# Altium schematic sheet [4] - EthernetPHY.SchDoc
size 420 x 297 mm; ENG_APP_DATE: --/--/--; DSN_APP_DATE: --/--/--; CHK_APP_DATE: --/--/--; DocumentNumber: 4; SheetNumber: 4; SheetTotal: 11
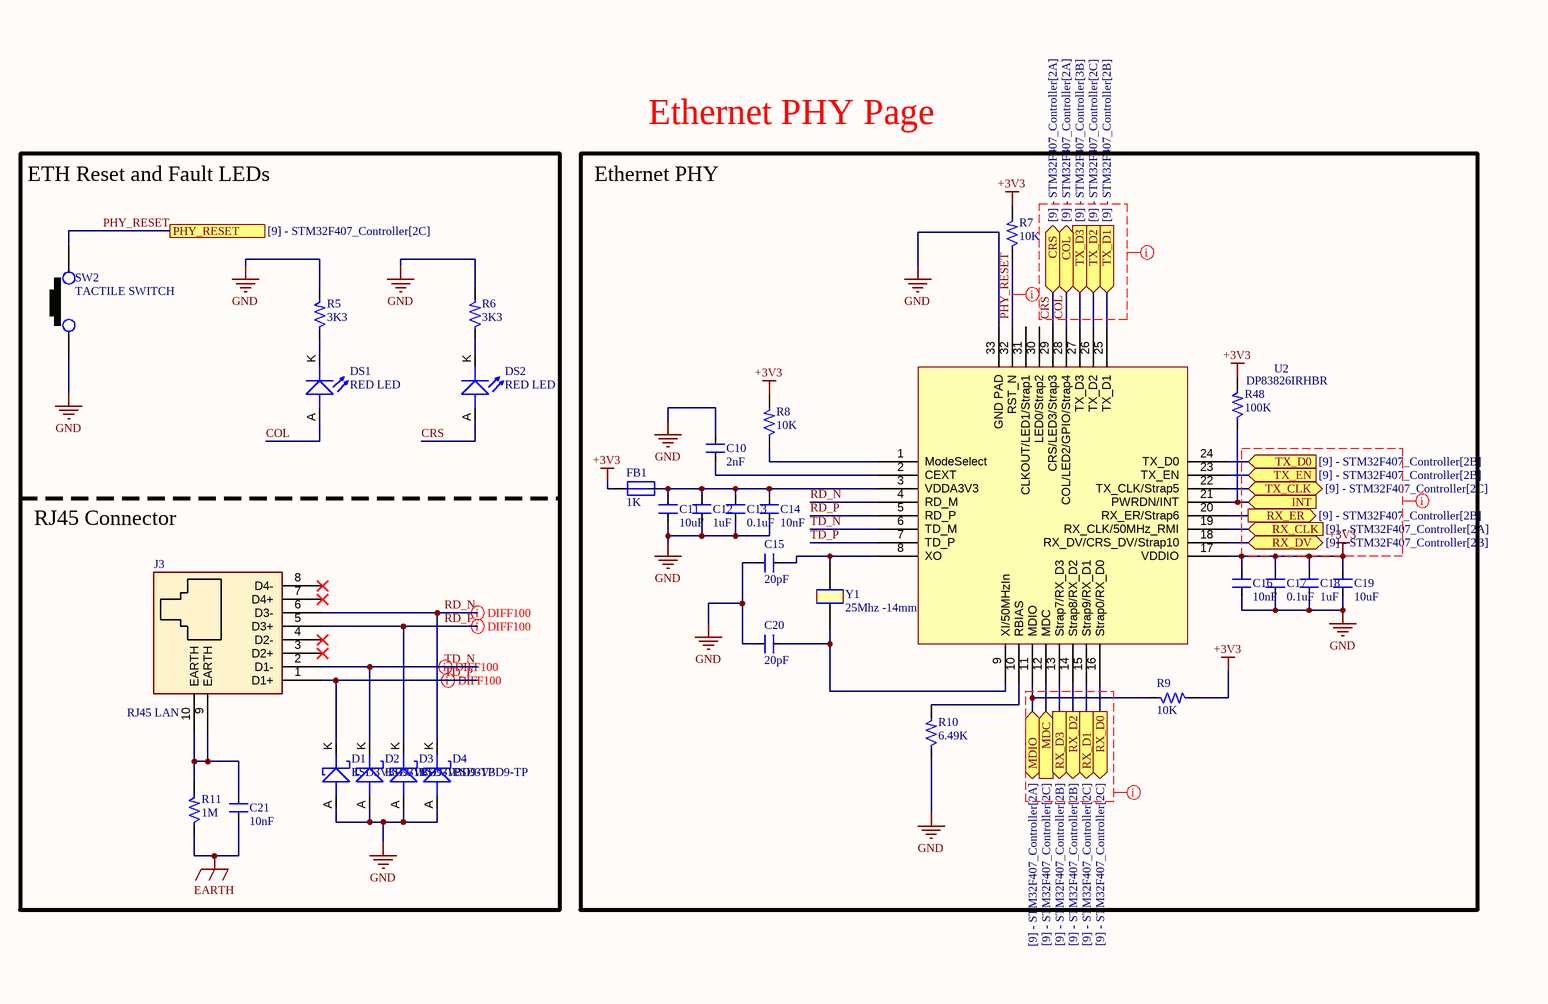
[diagram p0: [4] - EthernetPHY.SchDoc]

## Parts
C10  2nF  [CAP_0805]
C11  10uF  [CAP_1206]
C12  1uF  [CAP_0805]
C13  0.1uF  [CAP_0805]
C14  10nF  [CAP_0805]
C15  20pF  [CAP_0805]
C16  10nF  [CAP_0805]
C17  0.1uF  [CAP_0805]
C18  1uF  [CAP_0805]
C19  10uF  [CAP_1206]
C20  20pF  [CAP_0805]
C21  10nF  [CAP_P196_102X287_H332_RAD_TH]
D1  ESD3V3D9-TP  [DIO_SOD-923]
D2  ESD3V3D9-TP  [DIO_SOD-923]
D3  ESD3V3D9-TP  [DIO_SOD-923]
D4  ESD3V3D9-TP  [DIO_SOD-923]
DS1  RED LED  [LED_0805]
DS2  RED LED  [LED_0805]
FB1  1K  [IND_0805]
J3  RJ45 LAN  [CON10_P106_RJ45_TH_ST]
R5  3K3  [RES_0603]
R6  3K3  [RES_0603]
R7  10K  [RES_0603]
R8  10K  [RES_0603]
R9  10K  [RES_0603]
R10  6.49K  [RES_0805]
R11  1M  [RES_1206]
R48  100K  [RES_0603]
SW2  TACTILE SWITCH  [SW_342_SMD]
U2  DP83826IRHBR  [VQFN32_19_218_23X9_SMD]
Y1  25Mhz -14mm  [XTAL_314_240X47_SMD]

## Blocks framed on the sheet
Ethernet PHY: C10-C20 FB1 R7-R10 R48 U2 Y1

## Ports
COL (bidir, see [9] - STM32F407_Controller[2A]), CRS (bidir, see [9] - STM32F407_Controller[2A]), INT (in), MDC (in, see [9] - STM32F407_Controller[2C]), MDIO (bidir, see [9] - STM32F407_Controller[2A]), PHY_RESET (see [9] - STM32F407_Controller[2C]), RX_CLK (in, see [9] - STM32F407_Controller[2A]), RX_D0 (out, see [9] - STM32F407_Controller[2C]), RX_D1 (out, see [9] - STM32F407_Controller[2C]), RX_D2 (out, see [9] - STM32F407_Controller[2B]), RX_D3 (out, see [9] - STM32F407_Controller[2B]), RX_DV (bidir, see [9] - STM32F407_Controller[2B]), RX_ER (out, see [9] - STM32F407_Controller[2B]), TX_CLK (bidir, see [9] - STM32F407_Controller[2C]), TX_D0 (in, see [9] - STM32F407_Controller[2B]), TX_D1 (in, see [9] - STM32F407_Controller[2B]), TX_D2 (in, see [9] - STM32F407_Controller[2C]), TX_D3 (in, see [9] - STM32F407_Controller[3B]), TX_EN (in, see [9] - STM32F407_Controller[2B])

## Nets
+3V3: C16.1 C17.2 C18.1 C19.2 FB1.1 R7.2 R8.2 R9.2 R48.2 U2.17(VDDIO)
EARTH: C21.1 R11.1
GND: C10.1 C11.1 C12.1 C13.2 C14.1 C15.1 C16.2 C17.1 C18.2 C19.1 C20.1 D1.A D2.A D3.A D4.A R5.2 R6.2 R10.1 SW2.1 U2.33(GND_PAD)
COL: DS1.A(ANODE) U2.28(COL/LED2/GPIO/Strap4) ; port COL
CRS: DS2.A(ANODE) U2.29(CRS/LED3/Strap3) ; port CRS
INT: R48.1 U2.21(PWRDN/INT) ; port INT
MDC: U2.12(MDC) ; port MDC
MDIO: R9.1 U2.11(MDIO) ; port MDIO
PHY_RESET: R7.1 SW2.2 U2.32(RST_N) ; port PHY_RESET
RD_N: D4.K J3.6(D3-) U2.4(RD_M)
RD_P: D3.K J3.5(D3+) U2.5(RD_P)
RX_CLK: U2.19(RX_CLK/50MHz_RMI) ; port RX_CLK
RX_D0: U2.16(Strap0/RX_D0) ; port RX_D0
RX_D1: U2.15(Strap9/RX_D1) ; port RX_D1
RX_D2: U2.14(Strap8/RX_D2) ; port RX_D2
RX_D3: U2.13(Strap7/RX_D3) ; port RX_D3
RX_DV: U2.18(RX_DV/CRS_DV/Strap10) ; port RX_DV
RX_ER: U2.20(RX_ER/Strap6) ; port RX_ER
TD_N: D2.K J3.2(D1-) U2.6(TD_M)
TD_P: D1.K J3.1(D1+) U2.7(TD_P)
TX_CLK: U2.22(TX_CLK/Strap5) ; port TX_CLK
TX_D0: U2.24(TX_D0) ; port TX_D0
TX_D1: U2.25(TX_D1) ; port TX_D1
TX_D2: U2.26(TX_D2) ; port TX_D2
TX_D3: U2.27(TX_D3) ; port TX_D3
TX_EN: U2.23(TX_EN) ; port TX_EN
NetC10_2: C10.2 U2.2(CEXT)
NetC11_2: C11.2 C12.2 C13.1 C14.2 FB1.2 U2.3(VDDA3V3)
NetC15_2: C15.2 U2.8(XO) Y1.2
NetC20_2: C20.2 U2.9(XI/50MHzIn) Y1.1
NetC21_2: C21.2 J3.9(EARTH) J3.10(EARTH) R11.2
NetDS1_K: DS1.K(CATHODE) R5.1
NetDS2_K: DS2.K(CATHODE) R6.1
NetR8_1: R8.1 U2.1(ModeSelect)
NetR10_2: R10.2 U2.10(RBIAS)

Not connected (* = marked no-connect by the designer): J3 3(D2+)* 4(D2-)* 7(D4+)* 8(D4-)*; U2 30(LED0/Strap2) 31(CLKOUT/LED1/Strap1)

## Layout directives
differential pair; differential pair class DIFF100: RD_N, RD_P, TD_N, TD_P
net class 50OHM: (no net found under the mark), +3V3, COL, CRS
net class Critical_Nets: PHY_RESET

## Notes on the sheet
- Ethernet PHY Page
- ETH Reset and Fault LEDs
- RJ45 Connector
- THIS DOCUMENT AND THE DATA DISCLOSED HEREIN OR
- HEREWITH IS THE PROPERTY OF ALTIUM LIMITED AND MAY
- DWG NO:
- REVISION
- REV:
- DESCRIPTION
- DATE
- APPROVED
- BE FREELY DISTRIBUTED IN WHOLE. NO RIGHTS ARE
- RESERVED OR EXPRESS OR IMPLIED WARANTEE GIVEN.
- ENG:
- APPROVALS
- PROJECT
- DSN:
- CHK:
- REFERENCE DOCUMENTS
- PROJECT REVISION:
- TITLE
- DOCUMENT REVISION:
- DESIGN ITEM:
- BOM:
- FAB DWG:
- PCB DWG:
- ASSY DWG:
- SCALE:
- A3
- SIZE
- CAGE CODE
- FILE NAME
- DWG NO.
- SHEET
- OF
- REV

## Library data of the parts
C10 = CAP_2nF-50V-10%-0805: 2000pF ±10% 50V Ceramic Capacitor X7R 0805 (2012 Metric); Manufacturer: Samsung Electro-Mechanics; Manufacturer Part Number: CL21B202KBANNNC; Alternate Part Number-1: NA; Case/Package: 0805; Supplier-1: Digikey; Supplier Part Number-1: 1276-2471-1-ND - Cut Tape (CT)
C11 C19 = CAP_10uF-50V-10%-1206: 10µF ±10% 50V Ceramic Capacitor X7R 1206 (3216 Metric); Manufacturer: KEMET; Manufacturer Part Number: CL31B106KBHNNNE; Alternate Part Number-1: GRT31CR61H106ME01L; Case/Package: 1206; Supplier-1: SIRICOM; Supplier Part Number-1: CC1206KKX5R9BB106
C12 C18 = CAP_1uF-50V-5%-0805: 1µF ±5% 50V Ceramic Capacitor X7R 0805 (2012 Metric); Manufacturer: Samsung; Manufacturer Part Number: CC0805JKX7R9BB105; Alternate Part Number-1: 0805F105M500NT; Case/Package: 0805; Supplier-1: SIRICOM; Supplier Part Number-1: CL21B105KBFNNNE
C13 C17 = CAP_0.1uF-50V-5%-0805: 0.1µF ±5% 50V Ceramic Capacitor X7R 0805 (2012 Metric); Manufacturer: AVX Corporation; Manufacturer Part Number: 08055C104JAT4A; Alternate Part Number-1: 0805B104M500; Case/Package: 0805; Supplier-1: SIRICOM; Supplier Part Number-1: 0805B104J500CT
C14 C16 = CAP_10nF-50V-10%-0805: 10000pF ±10% 50V Ceramic Capacitor X7R 0805 (2012 Metric); Manufacturer: Samsung; Manufacturer Part Number: C0805C103K5RECAUTO; Alternate Part Number-1: GRM2195C1H103JA01D; Case/Package: 0805; Supplier-1: SIRICOM; Supplier Part Number-1: 0805B103K500CT
C15 C20 = CAP_20pF-50V-10%-0805: ±10% 50V Ceramic Capacitor C0G, NP0 0805 (2012 Metric); Manufacturer: AVX Corporation; Manufacturer Part Number: 08055A200KAT2A; Alternate Part Number-1: NA; Case/Package: 0805; Supplier-1: Digikey; Supplier Part Number-1: 478-11887-1-ND - Cut Tape (CT)
C21 = CAP_10nF-1KV-10%-RAD-TH: 10000pF ±10% 1000V (1kV) Ceramic Capacitor X7R Radial; Manufacturer: Yageo; Manufacturer Part Number: RDER73A103K2K1H03B; Alternate Part Number-1: NA; Case/Package: TH; Supplier-1: SP ROAD; Supplier Part Number-1: RDER73A103K2K1H03B
D1-D4 = DIO-T_3.3V-8.8V-10A-SOD923: TVS DIODE 3.3V 8.8V SOD923; Manufacturer: Micro Commercial Co; Alternate Part Number-1: NA; Manufacturer Part Number: ESD3V3D9-TP; Case/Package: SOD923; Supplier-1: Digikey; Supplier Part Number-1: ESD3V3D9-TPMSTR-ND
DS1 DS2 = LED_RED-2V-20mA-0805: Red 631nm LED Indication - Discrete 2V 0805 (2012 Metric); Manufacturer: Vishay Lite-On; Manufacturer Part Number: LTST-C171KRKT; Alternate Part Number-1: NA; Case/Package: 0805; Supplier-1: SP ROAD; Supplier Part Number-1: LTST-C171KRKT
FB1 = FB_1K-100MHZ-1.6A-0805: 1 kOhms @ 100MHz 1 Power Line Ferrite Bead 0805 (2012 Metric) 1.6A; Manufacturer: Laird; Manufacturer Part Number: BLM21SP102SH1D; Alternate Part Number-1: NA; Case/Package: 0805; Supplier-1: SIRICOM; Supplier Part Number-1: ACMS201209A102
J3 = CON-SKT-RJ_8C8P-RA-TH: 8 Pins, 2 Row 2.54mm Pitch, right angle Connector, male; Manufacturer: Assmann; Manufacturer Part Number: A-2004-2-4-LPS-N-R; Alternate Part Number-1: NA; Case/Package: TH-CON; Supplier-1: SP ROAD; Supplier Part Number-1: A-2004-2-4-LPS-N-R
R5 R6 = RES_3.3K-0.1W-1%-0603: 3.3 kOhms ±1% 0.1W, 1/10W Chip Resistor 0603 (1608 Metric) Automotive AEC-Q200 Thick Film; Manufacturer: Wilson; Manufacturer Part Number: WR06X3301FTL; Alternate Part Number-1: 0603WAF3301T5E; Case/Package: 0603; Supplier-1: SIRICOM; Supplier Part Number-1: WR06X3301FTL
R7-R9 = RES_10K-0.1W-1%-0603: 10 kOhms ±1% 0.1W, 1/10W Chip Resistor 0603 (1608 Metric) Automotive AEC-Q200 Thick Film; Manufacturer: Walsin; Manufacturer Part Number: WR06X1002FTL; Alternate Part Number-1: 0603WAJ0103T5E; Case/Package: 0603; Supplier-1: SIRICOM; Supplier Part Number-1: WR06X1002FTL
R10 = RES_6.49K-0.125W-1%-0805: 6.49 kOhms ±1% 0.125W, 1/8W Chip Resistor 0805 (2012 Metric) Moisture Resistant Thick Film; Manufacturer: Stackpole Electronics; Manufacturer Part Number: RC0805FR-076K49L; Alternate Part Number-1: NA; Case/Package: 0805; Supplier-1: SIRICOM; Supplier Part Number-1: WRO8X6491FTL
R11 = RES_1M-0.25W-1%-1206: 1 MOhms ±1% 0.25W, 1/4W Chip Resistor 1206 (3216 Metric) Automotive AEC-Q200, High Voltage Thick Film; Manufacturer: Walsin; Manufacturer Part Number: WR12X1004FTL; Alternate Part Number-1: NA; Case/Package: 1206; Supplier-1: SIRICOM; Supplier Part Number-1: WR12X1004FTL
R48 = RES_100K-0.1W-1%-0603: 100 kOhms ±1% 0.1W, 1/10W Chip Resistor 0603 (1608 Metric) Automotive AEC-Q200 Thick Film; Manufacturer: Stackpole Electronics; Manufacturer Part Number: RMCF0603FT100K; Alternate Part Number-1: NA; Case/Package: 0603; Supplier-1: Arrow; Supplier Part Number-1: RMCF0603FT100K
SW2 = SW1_RS-282G05A3-SMRT-SMD: Tactile Switch SPST-NO Top Actuated Surface Mount; Manufacturer: ITT C&K; Alternate Part Number-1: NA; Manufacturer Part Number: RS-282G05A3-SMRT; Case/Package: SMD; Supplier-1: SP ROAD; Supplier Part Number-1: RS-282G05A3-SMRT
U2 = IC_DP83826IRHBR: Ethernet ICs Low latency 10/100-Mbps PHY, MII interface and enhanced mode with an industrial temperature range 32-VQFN -40 to 85; Manufacturer: Texas Instruments; Alternate Part Number-1: NA; Manufacturer Part Number: DP83826IRHBR; Case/Package: 32-VQFN; Supplier-1: Mouser; Supplier Part Number-1: 595-DP83826IRHBR
Y1 = XTAL_25Mhz-FOXSDLF/250F-20: 25MHz ±30ppm Crystal 20pF 30 Ohms HC-49/US; Manufacturer: Abracon; Alternate Part Number-1: NA; Manufacturer Part Number: FOXSDLF/250F-20; Case/Package: SMD; Supplier-1: MOUSER; Supplier Part Number-1: FOXSDLF/250F-20